# Altium schematic sheet original_schematic.SchDoc
size A4; DocumentNumber: 1; SheetNumber: 1; SheetTotal: 3
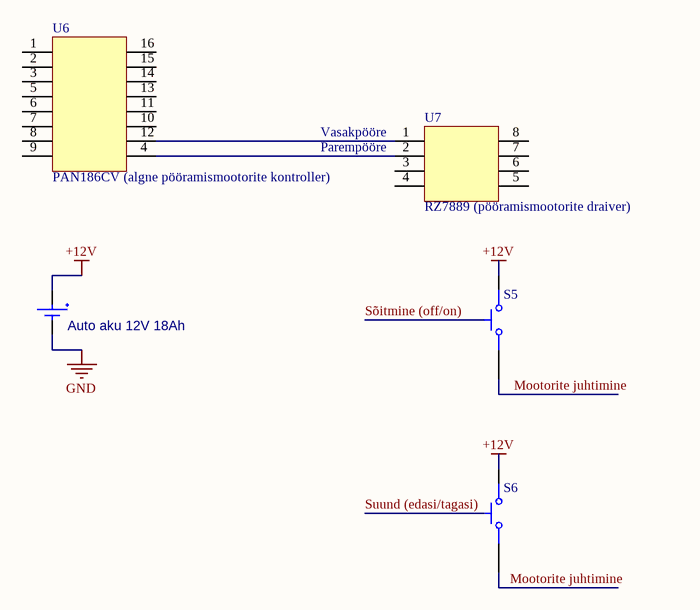
[diagram p0: original_schematic.SchDoc]

## Parts
Auto_aku_12V_18Ah  (no value)  [SEIK-MS621FE-FL11E-2_V]
S5  (no value)  [OMRON-B3U-1000_V]
S6  (no value)  [OMRON-B3U-1000_V]
U6  PAN186CV (algne pööramismootorite kontroller)
U7  RZ7889 (pööramismootorite draiver)

## Nets
+12V: Auto_aku_12V_18Ah.1(+) S5.2 S6.2
GND: Auto_aku_12V_18Ah.2(-)
Mootorite juhtimine: S5.1 S6.1
NetU6_4: U6.4 U7.2
NetU6_12: U6.12 U7.1

Not connected (* = marked no-connect by the designer): U6 1 2 3 5 6 7 8 9 10 11 13 14 15 16; U7 3 4 5 6 7 8

## Notes on the sheet
- (near U7) Vasakpööre
- (near U7) Parempööre

## Library data of the parts
Auto_aku_12V_18Ah = CMP-00029-00000-1: MS Lihium Rechargeable Battery, 3 V, -20 to 60 degC, Tray; RoHS Compliant: NotApplicable; Mounting Technology: WithLeads; Pins: 2
S5 S6 = CMP-011-00000-2: Tactile Switch, SPST-NO, 0.05 A, 12 V, -25 to 70 degC, 2-Pin SMD, RoHS, Tape and Reel; Manufacturer: Omron Electronic Components; IP Rating: IP40; Current Rating: 50mA; Max Contact Resistance: 100mohm; Operating Force: 153gf; Throw Configuration: SPST; Resistance: 0.1Ohm; Max Voltage Rating (DC): 12V; Contact Material: Silver; Max Current Rating: 50mA; Datasheet URL: http://www.omron.com/ecb/products/pdf/en-b3u.pdf; Mounting Technology: SM; Case/Package: B3U-1000; Packaging: TapeandReel; Package Reference: B3U-1000; Manufacturer URL: http://www.omron.com/; Datasheet Version: Jan-15; RoHS Compliant: True; Max Operating Temperature: 70°C; Contact Current Rating: 50mA; Package Quantity: 3500; Package Description: 2-Pin Surface Mount Device, Body 3 x 2.5 mm; Voltage Rating (DC): 12V; Min Operating Temperature: -25°C; Voltage Rating: 12V
U6 = CMP-016-00015-7
U7 = CMP-00024-00007-3